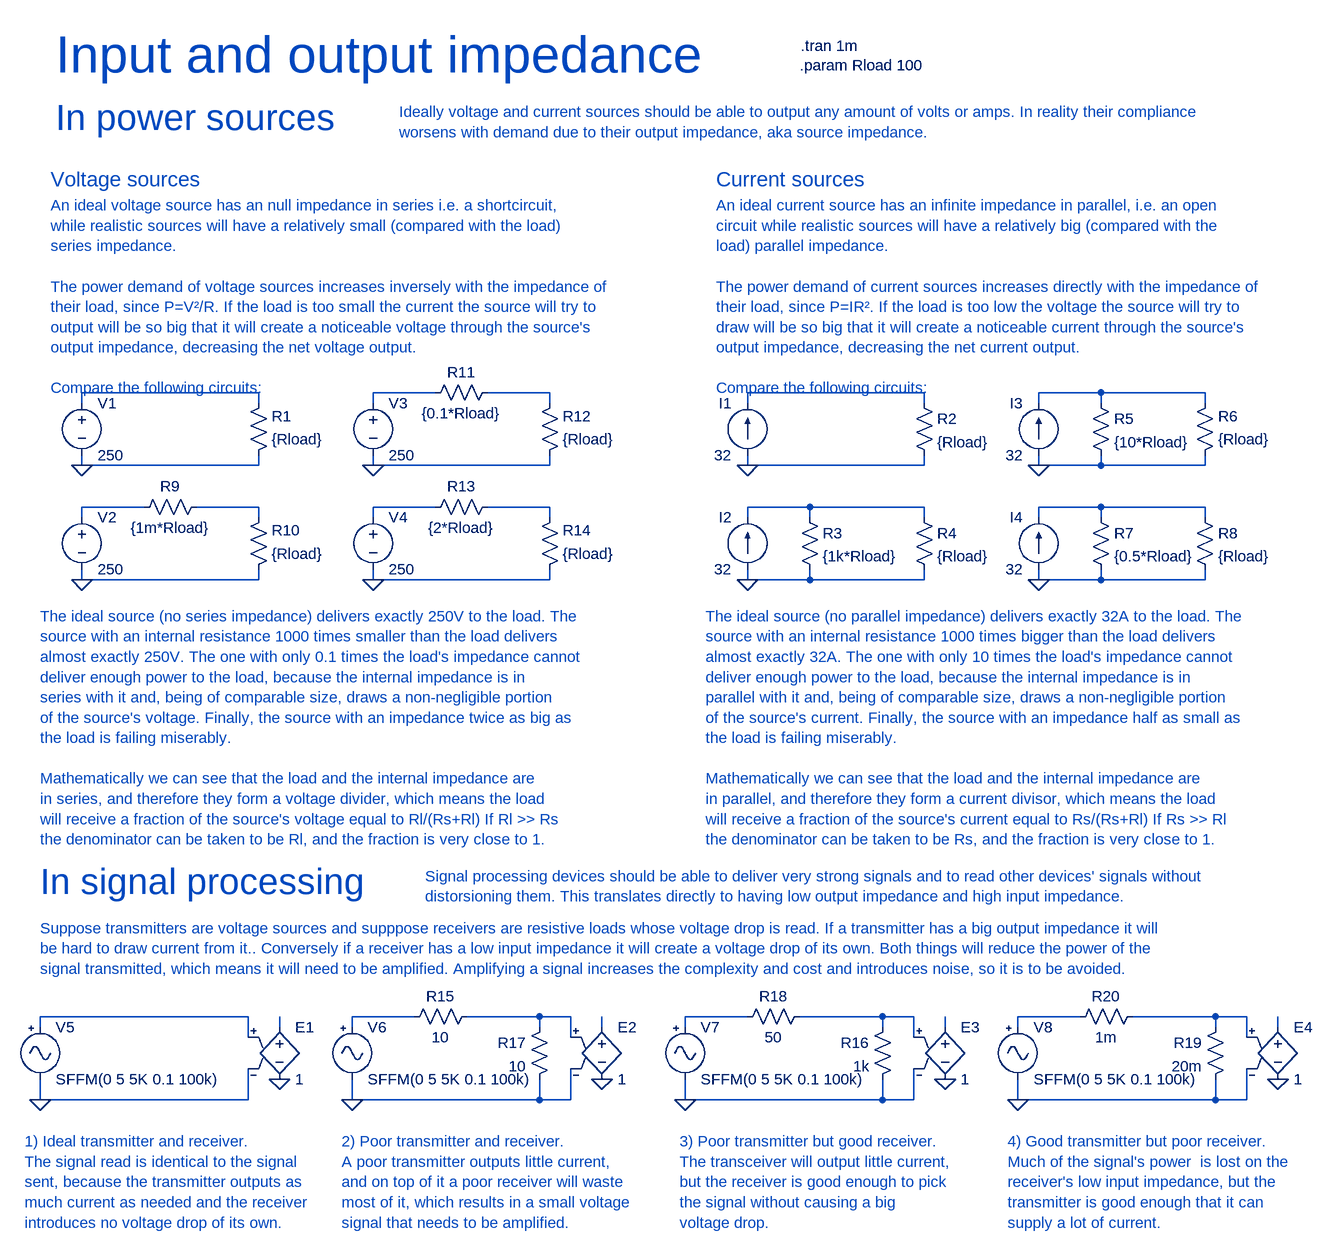
[diagram p0: schematic ioimpedance.asc]
ioimpedance.asc, the LTspice schematic file:
Version 4
SHEET 1 2368 1872
WIRE 288 592 16 592
WIRE 560 592 464 592
WIRE 736 592 640 592
WIRE 1312 592 1040 592
WIRE 1584 592 1488 592
WIRE 1744 592 1584 592
WIRE 16 608 16 592
WIRE 288 608 288 592
WIRE 464 608 464 592
WIRE 736 608 736 592
WIRE 1040 608 1040 592
WIRE 1312 608 1312 592
WIRE 1488 608 1488 592
WIRE 1584 608 1584 592
WIRE 1744 608 1744 592
WIRE 16 704 16 688
WIRE 288 704 288 688
WIRE 288 704 16 704
WIRE 464 704 464 688
WIRE 736 704 736 688
WIRE 736 704 464 704
WIRE 1040 704 1040 688
WIRE 1312 704 1312 688
WIRE 1312 704 1040 704
WIRE 1488 704 1488 688
WIRE 1584 704 1584 688
WIRE 1584 704 1488 704
WIRE 1744 704 1744 688
WIRE 1744 704 1584 704
WIRE 112 768 16 768
WIRE 288 768 192 768
WIRE 560 768 464 768
WIRE 736 768 640 768
WIRE 1136 768 1040 768
WIRE 1312 768 1136 768
WIRE 1584 768 1488 768
WIRE 1744 768 1584 768
WIRE 16 784 16 768
WIRE 288 784 288 768
WIRE 464 784 464 768
WIRE 736 784 736 768
WIRE 1040 784 1040 768
WIRE 1136 784 1136 768
WIRE 1312 784 1312 768
WIRE 1488 784 1488 768
WIRE 1584 784 1584 768
WIRE 1744 784 1744 768
WIRE 16 880 16 864
WIRE 288 880 288 864
WIRE 288 880 16 880
WIRE 464 880 464 864
WIRE 736 880 736 864
WIRE 736 880 464 880
WIRE 1040 880 1040 864
WIRE 1136 880 1136 864
WIRE 1136 880 1040 880
WIRE 1312 880 1312 864
WIRE 1312 880 1136 880
WIRE 1488 880 1488 864
WIRE 1584 880 1584 864
WIRE 1584 880 1488 880
WIRE 1744 880 1744 864
WIRE 1744 880 1584 880
WIRE 272 1552 -48 1552
WIRE 528 1552 432 1552
WIRE 720 1552 608 1552
WIRE 768 1552 720 1552
WIRE 1040 1552 944 1552
WIRE 1248 1552 1120 1552
WIRE 1296 1552 1248 1552
WIRE 1552 1552 1456 1552
WIRE 1760 1552 1632 1552
WIRE 1808 1552 1760 1552
WIRE -48 1568 -48 1552
WIRE 320 1568 320 1552
WIRE 432 1568 432 1552
WIRE 720 1568 720 1552
WIRE 816 1568 816 1552
WIRE 944 1568 944 1552
WIRE 1248 1568 1248 1552
WIRE 1344 1568 1344 1552
WIRE 1456 1568 1456 1552
WIRE 1760 1568 1760 1552
WIRE 1856 1568 1856 1552
WIRE 272 1584 272 1552
WIRE 768 1584 768 1552
WIRE 1296 1584 1296 1552
WIRE 1808 1584 1808 1552
WIRE -48 1680 -48 1648
WIRE 272 1680 272 1632
WIRE 272 1680 -48 1680
WIRE 432 1680 432 1648
WIRE 720 1680 720 1648
WIRE 720 1680 432 1680
WIRE 768 1680 768 1632
WIRE 768 1680 720 1680
WIRE 944 1680 944 1648
WIRE 1248 1680 1248 1648
WIRE 1248 1680 944 1680
WIRE 1296 1680 1296 1632
WIRE 1296 1680 1248 1680
WIRE 1456 1680 1456 1648
WIRE 1760 1680 1760 1648
WIRE 1760 1680 1456 1680
WIRE 1808 1680 1808 1632
WIRE 1808 1680 1760 1680
FLAG 1040 704 0
FLAG 1040 880 0
FLAG 1488 704 0
FLAG 1488 880 0
FLAG 16 704 0
FLAG 16 880 0
FLAG 464 704 0
FLAG 464 880 0
FLAG -48 1680 0
FLAG 320 1648 0
FLAG 432 1680 0
FLAG 816 1648 0
FLAG 944 1680 0
FLAG 1344 1648 0
FLAG 1456 1680 0
FLAG 1856 1648 0
SYMBOL current 1040 688 R180
WINDOW 0 24 80 Left 2
WINDOW 3 24 0 Left 2
WINDOW 123 0 0 Left 0
WINDOW 39 0 0 Left 0
SYMATTR InstName I1
SYMATTR Value 32
SYMBOL res 1296 592 R0
SYMATTR InstName R2
SYMATTR Value {Rload}
SYMBOL current 1040 864 R180
WINDOW 0 24 80 Left 2
WINDOW 3 24 0 Left 2
WINDOW 123 0 0 Left 0
WINDOW 39 0 0 Left 0
SYMATTR InstName I2
SYMATTR Value 32
SYMBOL res 1120 768 R0
SYMATTR InstName R3
SYMATTR Value {1k*Rload}
SYMBOL res 1296 768 R0
SYMATTR InstName R4
SYMATTR Value {Rload}
SYMBOL current 1488 688 R180
WINDOW 0 24 80 Left 2
WINDOW 3 24 0 Left 2
WINDOW 123 0 0 Left 0
WINDOW 39 0 0 Left 0
SYMATTR InstName I3
SYMATTR Value 32
SYMBOL res 1568 592 R0
SYMATTR InstName R5
SYMATTR Value {10*Rload}
SYMBOL res 1728 704 M180
WINDOW 0 36 76 Left 2
WINDOW 3 36 40 Left 2
SYMATTR InstName R6
SYMATTR Value {Rload}
SYMBOL current 1488 864 R180
WINDOW 0 24 80 Left 2
WINDOW 3 24 0 Left 2
WINDOW 123 0 0 Left 0
WINDOW 39 0 0 Left 0
SYMATTR InstName I4
SYMATTR Value 32
SYMBOL res 1568 768 R0
SYMATTR InstName R7
SYMATTR Value {0.5*Rload}
SYMBOL res 1728 768 R0
SYMATTR InstName R8
SYMATTR Value {Rload}
SYMBOL res 272 704 M180
WINDOW 0 36 76 Left 2
WINDOW 3 36 40 Left 2
SYMATTR InstName R1
SYMATTR Value {Rload}
SYMBOL res 208 752 R90
WINDOW 0 0 56 VBottom 2
WINDOW 3 32 56 VTop 2
SYMATTR InstName R9
SYMATTR Value {1m*Rload}
SYMBOL res 272 880 M180
WINDOW 0 36 76 Left 2
WINDOW 3 36 40 Left 2
SYMATTR InstName R10
SYMATTR Value {Rload}
SYMBOL res 656 576 R90
WINDOW 0 0 56 VBottom 2
WINDOW 3 32 56 VTop 2
SYMATTR InstName R11
SYMATTR Value {0.1*Rload}
SYMBOL res 720 704 M180
WINDOW 0 36 76 Left 2
WINDOW 3 36 40 Left 2
SYMATTR InstName R12
SYMATTR Value {Rload}
SYMBOL res 656 752 R90
WINDOW 0 0 56 VBottom 2
WINDOW 3 32 56 VTop 2
SYMATTR InstName R13
SYMATTR Value {2*Rload}
SYMBOL res 720 880 M180
WINDOW 0 36 76 Left 2
WINDOW 3 36 40 Left 2
SYMATTR InstName R14
SYMATTR Value {Rload}
SYMBOL voltage 16 592 R0
WINDOW 123 0 0 Left 0
WINDOW 39 0 0 Left 0
SYMATTR InstName V1
SYMATTR Value 250
SYMBOL voltage 16 768 R0
WINDOW 123 0 0 Left 0
WINDOW 39 0 0 Left 0
SYMATTR InstName V2
SYMATTR Value 250
SYMBOL voltage 464 592 R0
WINDOW 123 0 0 Left 0
WINDOW 39 0 0 Left 0
SYMATTR InstName V3
SYMATTR Value 250
SYMBOL voltage 464 768 R0
WINDOW 123 0 0 Left 0
WINDOW 39 0 0 Left 0
SYMATTR InstName V4
SYMATTR Value 250
SYMBOL Misc\\signal -48 1552 R0
WINDOW 123 0 0 Left 0
WINDOW 39 0 0 Left 0
SYMATTR InstName V5
SYMATTR Value SFFM(0 5 5K 0.1 100k)
SYMBOL e 320 1552 R0
SYMATTR InstName E1
SYMATTR Value 1
SYMBOL Misc\\signal 432 1552 R0
WINDOW 123 0 0 Left 0
WINDOW 39 0 0 Left 0
SYMATTR InstName V6
SYMATTR Value SFFM(0 5 5K 0.1 100k)
SYMBOL e 816 1552 R0
SYMATTR InstName E2
SYMATTR Value 1
SYMBOL res 736 1552 M0
SYMATTR InstName R17
SYMATTR Value 10
SYMBOL res 624 1536 R90
WINDOW 0 0 56 VBottom 2
WINDOW 3 32 56 VTop 2
SYMATTR InstName R15
SYMATTR Value 10
SYMBOL Misc\\signal 944 1552 R0
WINDOW 123 0 0 Left 0
WINDOW 39 0 0 Left 0
SYMATTR InstName V7
SYMATTR Value SFFM(0 5 5K 0.1 100k)
SYMBOL e 1344 1552 R0
SYMATTR InstName E3
SYMATTR Value 1
SYMBOL res 1264 1552 M0
SYMATTR InstName R16
SYMATTR Value 1k
SYMBOL res 1136 1536 R90
WINDOW 0 0 56 VBottom 2
WINDOW 3 32 56 VTop 2
SYMATTR InstName R18
SYMATTR Value 50
SYMBOL Misc\\signal 1456 1552 R0
WINDOW 123 0 0 Left 0
WINDOW 39 0 0 Left 0
SYMATTR InstName V8
SYMATTR Value SFFM(0 5 5K 0.1 100k)
SYMBOL e 1856 1552 R0
SYMATTR InstName E4
SYMATTR Value 1
SYMBOL res 1776 1552 M0
SYMATTR InstName R19
SYMATTR Value 20m
SYMBOL res 1648 1536 R90
WINDOW 0 0 56 VBottom 2
WINDOW 3 32 56 VTop 2
SYMATTR InstName R20
SYMATTR Value 1m
TEXT -24 72 Left 6 ;Input and output impedance
TEXT -24 168 Left 5 ;In power sources
TEXT 504 160 Left 2 ;Ideally voltage and current sources should be able to output any amount of volts or amps. In reality their compliance \nworsens with demand due to their output impedance, aka source impedance.
TEXT 992 264 Left 3 ;Current sources
TEXT 992 304 Left 2 ;An ideal current source has an infinite impedance in parallel, i.e. an open \ncircuit while realistic sources will have a relatively big (compared with the\nload) parallel impedance.\n \nThe power demand of current sources increases directly with the impedance of\ntheir load, since P=IR². If the load is too low the voltage the source will try to \ndraw will be so big that it will create a noticeable current through the source's \noutput impedance, decreasing the net current output.\n \nCompare the following circuits:
TEXT 1122 58 Left 2 !.tran 1m
TEXT 1120 88 Left 2 !.param Rload 100
TEXT 976 936 Left 2 ;The ideal source (no parallel impedance) delivers exactly 32A to the load. The \nsource with an internal resistance 1000 times bigger than the load delivers\nalmost exactly 32A. The one with only 10 times the load's impedance cannot \ndeliver enough power to the load, because the internal impedance is in \nparallel with it and, being of comparable size, draws a non-negligible portion \nof the source's current. Finally, the source with an impedance half as small as \nthe load is failing miserably.\n \nMathematically we can see that the load and the internal impedance are\nin parallel, and therefore they form a current divisor, which means the load\nwill receive a fraction of the source's current equal to Rs/(Rs+Rl) If Rs >> Rl\nthe denominator can be taken to be Rs, and the fraction is very close to 1.
TEXT -32 264 Left 3 ;Voltage sources
TEXT -32 304 Left 2 ;An ideal voltage source has an null impedance in series i.e. a shortcircuit,\nwhile realistic sources will have a relatively small (compared with the load) \nseries impedance.\n \nThe power demand of voltage sources increases inversely with the impedance of\ntheir load, since P=V²/R. If the load is too small the current the source will try to \noutput will be so big that it will create a noticeable voltage through the source's \noutput impedance, decreasing the net voltage output.\n \nCompare the following circuits:
TEXT -48 936 Left 2 ;The ideal source (no series impedance) delivers exactly 250V to the load. The \nsource with an internal resistance 1000 times smaller than the load delivers\nalmost exactly 250V. The one with only 0.1 times the load's impedance cannot \ndeliver enough power to the load, because the internal impedance is in \nseries with it and, being of comparable size, draws a non-negligible portion \nof the source's voltage. Finally, the source with an impedance twice as big as \nthe load is failing miserably.\n \nMathematically we can see that the load and the internal impedance are\nin series, and therefore they form a voltage divider, which means the load\nwill receive a fraction of the source's voltage equal to Rl/(Rs+Rl) If Rl >> Rs\nthe denominator can be taken to be Rl, and the fraction is very close to 1.
TEXT -48 1344 Left 5 ;In signal processing
TEXT 544 1336 Left 2 ;Signal processing devices should be able to deliver very strong signals and to read other devices' signals without \ndistorsioning them. This translates directly to having low output impedance and high input impedance.
TEXT -48 1416 Left 2 ;Suppose transmitters are voltage sources and supppose receivers are resistive loads whose voltage drop is read. If a transmitter has a big output impedance it will \nbe hard to draw current from it.. Conversely if a receiver has a low input impedance it will create a voltage drop of its own. Both things will reduce the power of the\nsignal transmitted, which means it will need to be amplified. Amplifying a signal increases the complexity and cost and introduces noise, so it is to be avoided.
TEXT -72 1744 Left 2 ;1) Ideal transmitter and receiver.\nThe signal read is identical to the signal \nsent, because the transmitter outputs as\nmuch current as needed and the receiver\nintroduces no voltage drop of its own.
TEXT 416 1744 Left 2 ;2) Poor transmitter and receiver.\nA poor transmitter outputs little current,\nand on top of it a poor receiver will waste\nmost of it, which results in a small voltage\nsignal that needs to be amplified.
TEXT 936 1744 Left 2 ;3) Poor transmitter but good receiver.\nThe transceiver will output little current,\nbut the receiver is good enough to pick\nthe signal without causing a big \nvoltage drop.
TEXT 1440 1744 Left 2 ;4) Good transmitter but poor receiver.\nMuch of the signal's power  is lost on the \nreceiver's low input impedance, but the\ntransmitter is good enough that it can\nsupply a lot of current.

The netlist it stands for:
* ioimpedance.asc
I1 0 N004 32
R2 N004 0 {Rload}
I2 0 N010 32
R3 N010 0 {1k*Rload}
R4 N010 0 {Rload}
I3 0 N005 32
R5 N005 0 {10*Rload}
R6 0 N005 {Rload}
I4 0 N011 32
R7 N011 0 {0.5*Rload}
R8 N011 0 {Rload}
R1 0 N001 {Rload}
R9 N007 N006 {1m*Rload}
R10 0 N007 {Rload}
R11 N003 N002 {0.1*Rload}
R12 0 N003 {Rload}
R13 N009 N008 {2*Rload}
R14 0 N009 {Rload}
V1 N001 0 250
V2 N006 0 250
V3 N002 0 250
V4 N008 0 250
V5 N012 0 SFFM(0 5 5K 0.1 100k)
E1 N019 0 N012 0 1
V6 N013 0 SFFM(0 5 5K 0.1 100k)
E2 N020 0 N014 0 1
R17 N014 0 10
R15 N014 N013 10
V7 N015 0 SFFM(0 5 5K 0.1 100k)
E3 N021 0 N016 0 1
R16 N016 0 1k
R18 N016 N015 50
V8 N017 0 SFFM(0 5 5K 0.1 100k)
E4 N022 0 N018 0 1
R19 N018 0 20m
R20 N018 N017 1m
* Input and output impedance
* In power sources
* Ideally voltage and current sources should be able to output any amount of volts or amps. In reality their compliance
* worsens with demand due to their output impedance, aka source impedance.
* Current sources
* An ideal current source has an infinite impedance in parallel, i.e. an open
* circuit while realistic sources will have a relatively big (compared with the
* load) parallel impedance.
* The power demand of current sources increases directly with the impedance of
* their load, since P=IR². If the load is too low the voltage the source will try to
* draw will be so big that it will create a noticeable current through the source's
* output impedance, decreasing the net current output.
* Compare the following circuits:
.tran 1m
.param Rload 100
* The ideal source (no parallel impedance) delivers exactly 32A to the load. The
* source with an internal resistance 1000 times bigger than the load delivers
* almost exactly 32A. The one with only 10 times the load's impedance cannot
* deliver enough power to the load, because the internal impedance is in
* parallel with it and, being of comparable size, draws a non-negligible portion
* of the source's current. Finally, the source with an impedance half as small as
* the load is failing miserably.
* Mathematically we can see that the load and the internal impedance are
* in parallel, and therefore they form a current divisor, which means the load
* will receive a fraction of the source's current equal to Rs/(Rs+Rl) If Rs >> Rl
* the denominator can be taken to be Rs, and the fraction is very close to 1.
* Voltage sources
* An ideal voltage source has an null impedance in series i.e. a shortcircuit,
* while realistic sources will have a relatively small (compared with the load)
* series impedance.
* The power demand of voltage sources increases inversely with the impedance of
* their load, since P=V²/R. If the load is too small the current the source will try to
* output will be so big that it will create a noticeable voltage through the source's
* output impedance, decreasing the net voltage output.
* Compare the following circuits:
* The ideal source (no series impedance) delivers exactly 250V to the load. The
* source with an internal resistance 1000 times smaller than the load delivers
* almost exactly 250V. The one with only 0.1 times the load's impedance cannot
* deliver enough power to the load, because the internal impedance is in
* series with it and, being of comparable size, draws a non-negligible portion
* of the source's voltage. Finally, the source with an impedance twice as big as
* the load is failing miserably.
* Mathematically we can see that the load and the internal impedance are
* in series, and therefore they form a voltage divider, which means the load
* will receive a fraction of the source's voltage equal to Rl/(Rs+Rl) If Rl >> Rs
* the denominator can be taken to be Rl, and the fraction is very close to 1.
* In signal processing
* Signal processing devices should be able to deliver very strong signals and to read other devices' signals without
* distorsioning them. This translates directly to having low output impedance and high input impedance.
* Suppose transmitters are voltage sources and supppose receivers are resistive loads whose voltage drop is read. If a transmitter has a big output impedance it will
* be hard to draw current from it.. Conversely if a receiver has a low input impedance it will create a voltage drop of its own. Both things will reduce the power of the
* signal transmitted, which means it will need to be amplified. Amplifying a signal increases the complexity and cost and introduces noise, so it is to be avoided.
* 1) Ideal transmitter and receiver.
* The signal read is identical to the signal
* sent, because the transmitter outputs as
* much current as needed and the receiver
* introduces no voltage drop of its own.
* 2) Poor transmitter and receiver.
* A poor transmitter outputs little current,
* and on top of it a poor receiver will waste
* most of it, which results in a small voltage
* signal that needs to be amplified.
* 3) Poor transmitter but good receiver.
* The transceiver will output little current,
* but the receiver is good enough to pick
* the signal without causing a big
* voltage drop.
* 4) Good transmitter but poor receiver.
* Much of the signal's power  is lost on the
* receiver's low input impedance, but the
* transmitter is good enough that it can
* supply a lot of current.
.backanno
.end